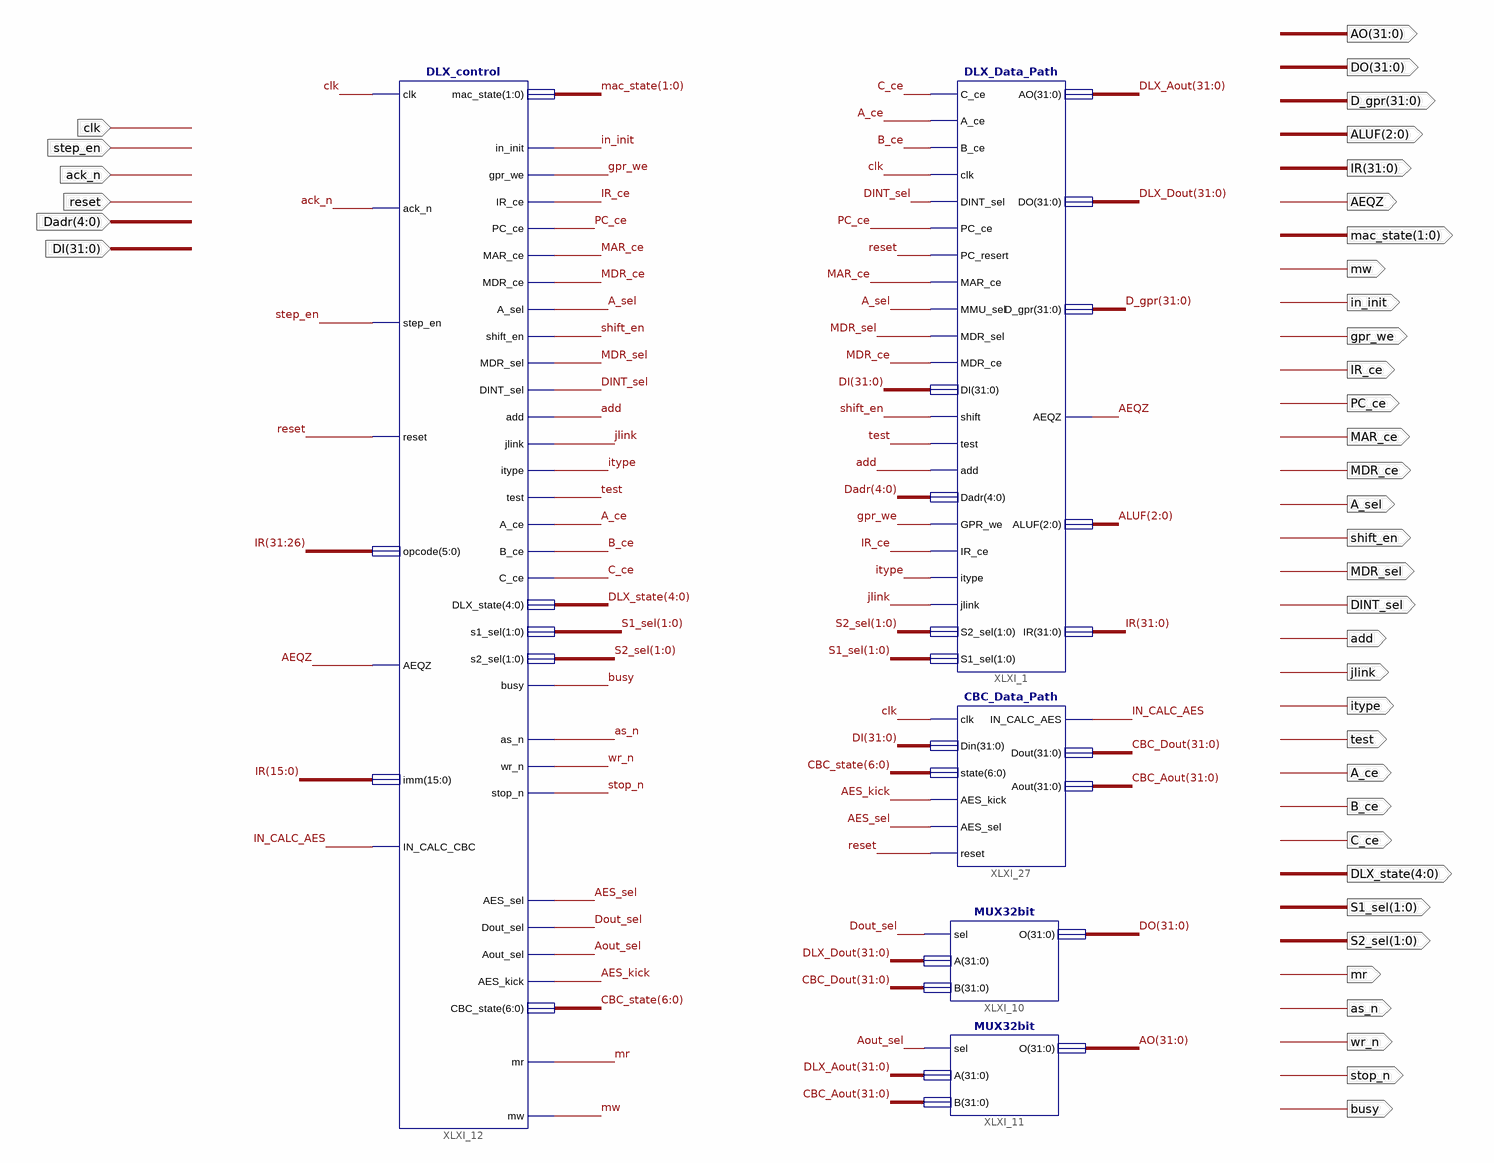
[diagram p0: schematic sheet 1]
// Xilinx ISE schematic DLX_env.sch (spartan6) as structural Verilog: 5 symbols, 39 ports
module DLX_env (
  input  clk,
  input  [31:0] DI,
  input  step_en,
  input  reset,
  input  ack_n,
  input  [4:0] Dadr,
  output [1:0] mac_state,
  output mw,
  output in_init,
  output gpr_we,
  output IR_ce,
  output PC_ce,
  output MAR_ce,
  output MDR_ce,
  output A_sel,
  output shift_en,
  output MDR_sel,
  output DINT_sel,
  output add,
  output jlink,
  output itype,
  output test,
  output A_ce,
  output B_ce,
  output C_ce,
  output [4:0] DLX_state,
  output [1:0] S1_sel,
  output [1:0] S2_sel,
  output busy,
  output mr,
  output as_n,
  output wr_n,
  output stop_n,
  output [31:0] AO,
  output [31:0] DO,
  output [31:0] D_gpr,
  output AEQZ,
  output [2:0] ALUF,
  output [31:0] IR
);

  wire AES_kick, AES_sel, Aout_sel, Dout_sel, IN_CALC_AES;
  wire [6:0] CBC_state;
  wire [31:0] CBC_Aout, CBC_Dout, DLX_Aout, DLX_Dout;

  DLX_Data_Path XLXI_1 (
    .C_ce(C_ce), .A_ce(A_ce), .B_ce(B_ce), .clk(clk), .DINT_sel(DINT_sel), .PC_ce(PC_ce), .PC_resert(reset),
    .MAR_ce(MAR_ce), .MMU_sel(A_sel), .MDR_sel(MDR_sel), .MDR_ce(MDR_ce), .DI(DI), .shift(shift_en),
    .test(test), .add(add), .Dadr(Dadr), .GPR_we(gpr_we), .IR_ce(IR_ce), .itype(itype), .jlink(jlink),
    .S2_sel(S2_sel), .S1_sel(S1_sel), .AO(DLX_Aout), .DO(DLX_Dout), .D_gpr(D_gpr), .AEQZ(AEQZ), .ALUF(ALUF),
    .IR(IR));
  DLX_control XLXI_12 (
    .clk(clk), .ack_n(ack_n), .step_en(step_en), .reset(reset), .opcode(IR[31:26]), .AEQZ(AEQZ),
    .imm(IR[15:0]), .IN_CALC_CBC(IN_CALC_AES), .mac_state(mac_state), .in_init(in_init), .gpr_we(gpr_we),
    .IR_ce(IR_ce), .PC_ce(PC_ce), .MAR_ce(MAR_ce), .MDR_ce(MDR_ce), .A_sel(A_sel), .shift_en(shift_en),
    .MDR_sel(MDR_sel), .DINT_sel(DINT_sel), .add(add), .jlink(jlink), .itype(itype), .test(test),
    .A_ce(A_ce), .B_ce(B_ce), .C_ce(C_ce), .DLX_state(DLX_state), .s1_sel(S1_sel), .s2_sel(S2_sel),
    .busy(busy), .as_n(as_n), .wr_n(wr_n), .stop_n(stop_n), .AES_sel(AES_sel), .Dout_sel(Dout_sel),
    .Aout_sel(Aout_sel), .AES_kick(AES_kick), .CBC_state(CBC_state), .mr(mr), .mw(mw));
  MUX32bit XLXI_11 (.sel(Aout_sel), .A(DLX_Aout), .B(CBC_Aout), .O(AO));
  MUX32bit XLXI_10 (.sel(Dout_sel), .A(DLX_Dout), .B(CBC_Dout), .O(DO));
  CBC_Data_Path XLXI_27 (
    .clk(clk), .Din(DI), .state(CBC_state), .AES_kick(AES_kick), .AES_sel(AES_sel), .reset(reset),
    .IN_CALC_AES(IN_CALC_AES), .Dout(CBC_Dout), .Aout(CBC_Aout));
endmodule
